# Altium schematic sheet fpga-bank3-outside.SchDoc: FPGA - Bank 3
size Letter; CheckedBy: E. Chiu; CompanyName: Brinton Engineering, LLC; DrawnBy: J. Brinton; Engineer: J. Brinton; Address1: 3479 Edison Way; Address2: Menlo Park CA 94025; Address3: +1 (877) 778-8435; Address4: brintonengineering.com; Revision: 1; SheetNumber: 11; SheetTotal: 48
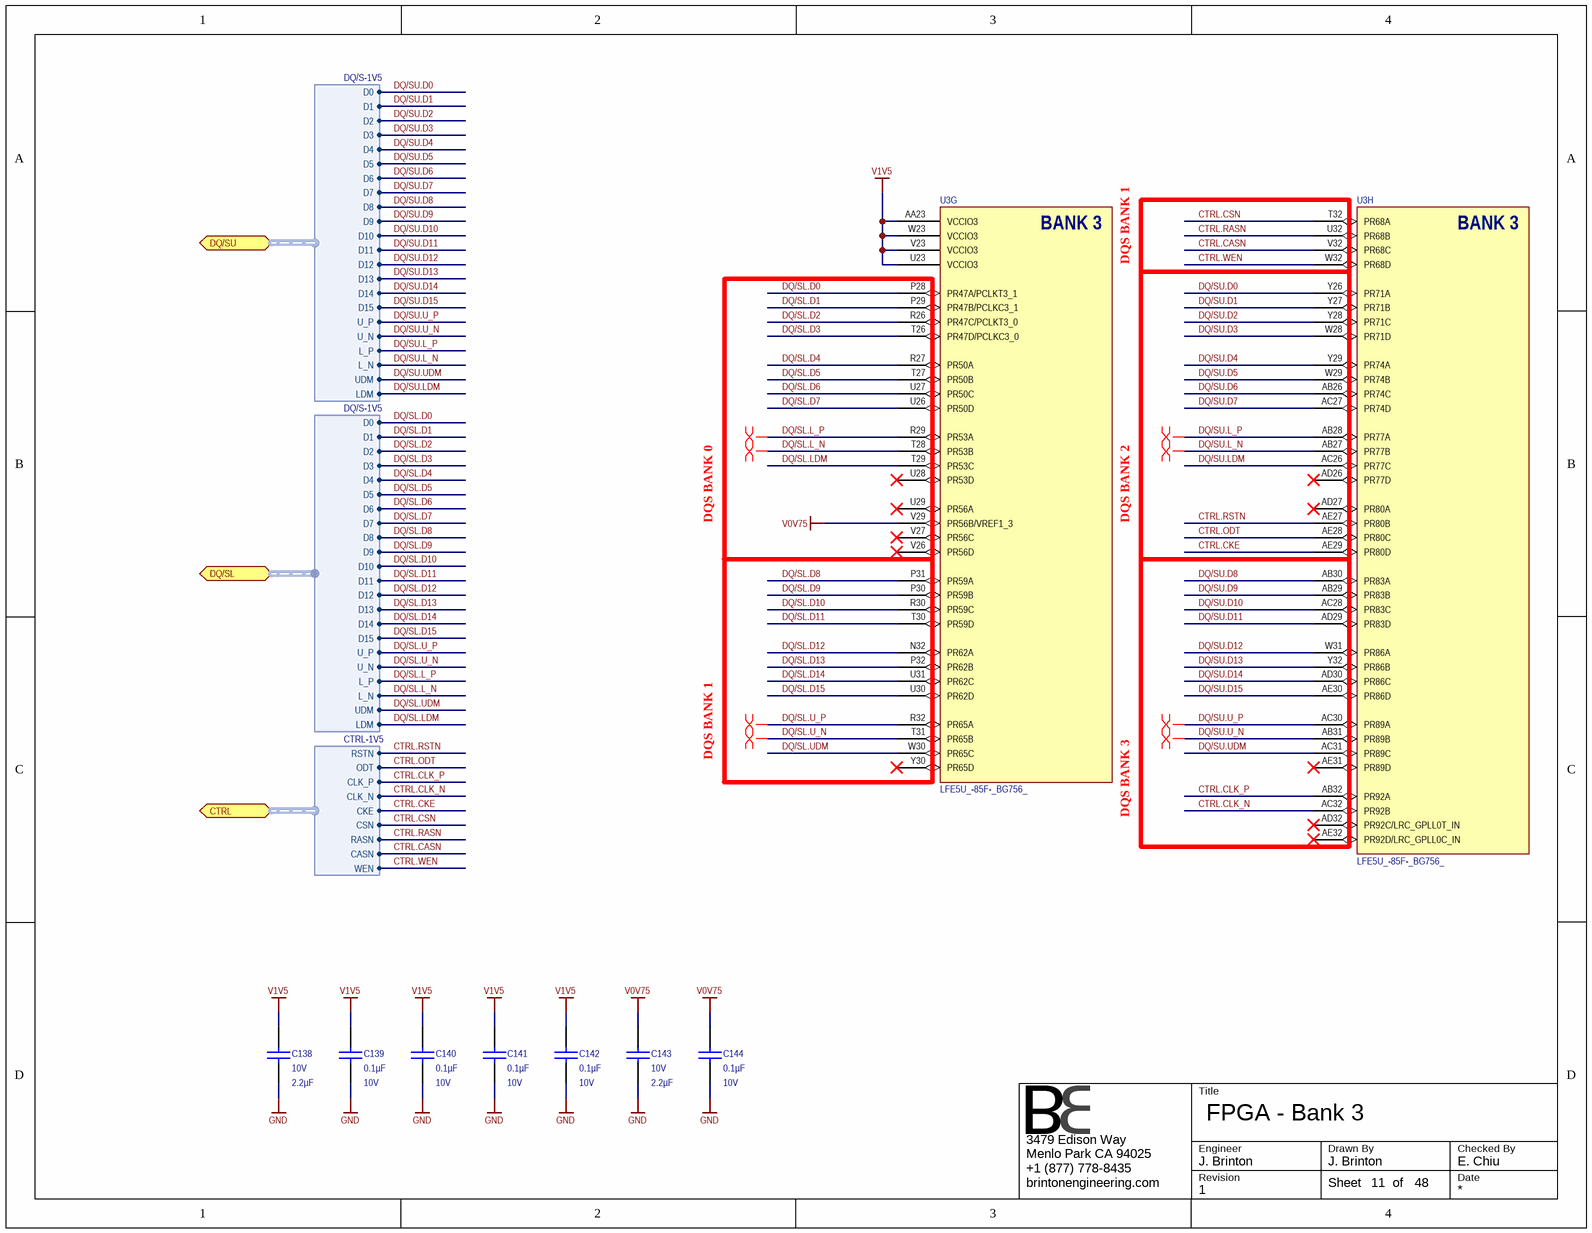
[diagram p0: fpga-bank3-outside.SchDoc]

## Parts
C138  Voltage - Rated: 10V  Capacitance: 2.2µF  [CAPC1608X90N]  (hidden comment: GRM188R71A225KE15D)
C139  Capacitance: 0.1µF  Voltage - Rated: 10V  [CAPC1005X56N]  (hidden comment: GRM155R71A104KA01J)
C140  Capacitance: 0.1µF  Voltage - Rated: 10V  [CAPC1005X56N]  (hidden comment: GRM155R71A104KA01J)
C141  Capacitance: 0.1µF  Voltage - Rated: 10V  [CAPC1005X56N]  (hidden comment: GRM155R71A104KA01J)
C142  Capacitance: 0.1µF  Voltage - Rated: 10V  [CAPC1005X56N]  (hidden comment: GRM155R71A104KA01J)
C143  Voltage - Rated: 10V  Capacitance: 2.2µF  [CAPC1608X90N]  (hidden comment: GRM188R71A225KE15D)
C144  Capacitance: 0.1µF  Voltage - Rated: 10V  [CAPC1005X56N]  (hidden comment: GRM155R71A104KA01J)
U3  LFE5U_-85F-_BG756_  [caBGA756]  (parts G,H of 19)

## Ports
CTRL (harness CTRL-1V5), DQ/SL (harness DQ/S-1V5), DQ/SU (harness DQ/S-1V5)

## Harnesses
DQ/S-1V5: D0, D1, D2, D3, D4, D5, D6, D7, D8, D9, D10, D11, D12, D13, D14, D15, U_P, U_N, L_P, L_N, UDM, LDM
CTRL-1V5: RSTN, CLK_P, CLK_N, CKE, CSN, RASN, CASN, WEN, ODT

## Nets
GND: C138.1 C139.1 C140.1 C141.1 C142.1 C143.1 C144.1
V0V75: C143.2 C144.2 U3.V29(PR56B/VREF1_3)
V1V5: C138.2 C139.2 C140.2 C141.2 C142.2 U3.AA23(VCCIO3) U3.U23(VCCIO3) U3.V23(VCCIO3) U3.W23(VCCIO3)
CTRL.CASN: U3.V32(PR68C) ; port CTRL.CASN
CTRL.CKE: U3.AE29(PR80D) ; port CTRL.CKE
CTRL.CLK_N: U3.AC32(PR92B) ; port CTRL.CLK_N
CTRL.CLK_P: U3.AB32(PR92A) ; port CTRL.CLK_P
CTRL.CSN: U3.T32(PR68A) ; port CTRL.CSN
CTRL.ODT: U3.AE28(PR80C) ; port CTRL.ODT
CTRL.RASN: U3.U32(PR68B) ; port CTRL.RASN
CTRL.RSTN: U3.AE27(PR80B) ; port CTRL.RSTN
CTRL.WEN: U3.W32(PR68D) ; port CTRL.WEN
DQ/SL.D0: U3.P28(PR47A/PCLKT3_1) ; port DQ/SL.D0
DQ/SL.D1: U3.P29(PR47B/PCLKC3_1) ; port DQ/SL.D1
DQ/SL.D2: U3.R26(PR47C/PCLKT3_0) ; port DQ/SL.D2
DQ/SL.D3: U3.T26(PR47D/PCLKC3_0) ; port DQ/SL.D3
DQ/SL.D4: U3.R27(PR50A) ; port DQ/SL.D4
DQ/SL.D5: U3.T27(PR50B) ; port DQ/SL.D5
DQ/SL.D6: U3.U27(PR50C) ; port DQ/SL.D6
DQ/SL.D7: U3.U26(PR50D) ; port DQ/SL.D7
DQ/SL.D8: U3.P31(PR59A) ; port DQ/SL.D8
DQ/SL.D9: U3.P30(PR59B) ; port DQ/SL.D9
DQ/SL.D10: U3.R30(PR59C) ; port DQ/SL.D10
DQ/SL.D11: U3.T30(PR59D) ; port DQ/SL.D11
DQ/SL.D12: U3.N32(PR62A) ; port DQ/SL.D12
DQ/SL.D13: U3.P32(PR62B) ; port DQ/SL.D13
DQ/SL.D14: U3.U31(PR62C) ; port DQ/SL.D14
DQ/SL.D15: U3.U30(PR62D) ; port DQ/SL.D15
DQ/SL.L_N: U3.T28(PR53B) ; port DQ/SL.L_N
DQ/SL.L_P: U3.R29(PR53A) ; port DQ/SL.L_P
DQ/SL.LDM: U3.T29(PR53C) ; port DQ/SL.LDM
DQ/SL.U_N: U3.T31(PR65B) ; port DQ/SL.U_N
DQ/SL.U_P: U3.R32(PR65A) ; port DQ/SL.U_P
DQ/SL.UDM: U3.W30(PR65C) ; port DQ/SL.UDM
DQ/SU.D0: U3.Y26(PR71A) ; port DQ/SU.D0
DQ/SU.D1: U3.Y27(PR71B) ; port DQ/SU.D1
DQ/SU.D2: U3.Y28(PR71C) ; port DQ/SU.D2
DQ/SU.D3: U3.W28(PR71D) ; port DQ/SU.D3
DQ/SU.D4: U3.Y29(PR74A) ; port DQ/SU.D4
DQ/SU.D5: U3.W29(PR74B) ; port DQ/SU.D5
DQ/SU.D6: U3.AB26(PR74C) ; port DQ/SU.D6
DQ/SU.D7: U3.AC27(PR74D) ; port DQ/SU.D7
DQ/SU.D8: U3.AB30(PR83A) ; port DQ/SU.D8
DQ/SU.D9: U3.AB29(PR83B) ; port DQ/SU.D9
DQ/SU.D10: U3.AC28(PR83C) ; port DQ/SU.D10
DQ/SU.D11: U3.AD29(PR83D) ; port DQ/SU.D11
DQ/SU.D12: U3.W31(PR86A) ; port DQ/SU.D12
DQ/SU.D13: U3.Y32(PR86B) ; port DQ/SU.D13
DQ/SU.D14: U3.AD30(PR86C) ; port DQ/SU.D14
DQ/SU.D15: U3.AE30(PR86D) ; port DQ/SU.D15
DQ/SU.L_N: U3.AB27(PR77B) ; port DQ/SU.L_N
DQ/SU.L_P: U3.AB28(PR77A) ; port DQ/SU.L_P
DQ/SU.LDM: U3.AC26(PR77C) ; port DQ/SU.LDM
DQ/SU.U_N: U3.AB31(PR89B) ; port DQ/SU.U_N
DQ/SU.U_P: U3.AC30(PR89A) ; port DQ/SU.U_P
DQ/SU.UDM: U3.AC31(PR89C) ; port DQ/SU.UDM

Not connected (* = marked no-connect by the designer): U3 AD26(PR77D)* AD27(PR80A)* AD32(PR92C/LRC_GPLL0T_IN)* AE31(PR89D)* AE32(PR92D/LRC_GPLL0C_IN)* U28(PR53D)* U29(PR56A)* V26(PR56D)* V27(PR56C)* Y30(PR65D)*

## Layout directives
differential pair: DQ/SL.L_N, DQ/SL.L_P, DQ/SL.U_N, DQ/SL.U_P, DQ/SU.L_N, DQ/SU.L_P, DQ/SU.U_N, DQ/SU.U_P

## Notes on the sheet
- DQS BANK 1
- DQS BANK 0
- DQS BANK 2
- DQS BANK 3
- Title
- Engineer
- Revision
- Drawn By
- Checked By
- Date
- Sheet
- of
- (in symbol LFE5U_-85F-_BG756_, part G) BANK 3
- (in symbol LFE5U_-85F-_BG756_, part H) BANK 3

## Library data of the parts
C138 C143 = GRM188R71A225KE15D: CAP CER 2.2UF 10V 10% X7R 0603; Manufacturer: Murata Electronics North America; Manufacturer P/N: GRM188R71A225KE15D; Operating Temperature: -55°C ~ 125°C; Thickness (Max): 0.035" (0.90mm); Tolerance: ±10%; Package / Case: 0603 (1608 Metric); Temperature Coefficient: X7R; Supplier 1: Newark; Supplier 2: Digi-Key; RoHS: RoHS Compliant; Size / Dimension: 0.063" L x 0.031" W (1.60mm x 0.80mm); Mounting Type: Surface Mount, MLCC; ComponentLink1URL: http://www.murata.com/~/media/webrenewal/support/library/catalog/products/capacitor/mlcc/c02e.ashx; ComponentLink1Description: http://www.murata.com/~/media/webrenewal/support/library/catalog/products/capacitor/mlcc/c02e.ashx; Supplier Part Number 1: 72R4209; Supplier Part Number 2: 490-4520-1-ND
C139-C142 C144 = GRM155R71A104KA01J: CAP CER 0.1UF 10V 10% X7R 0402; Manufacturer: Murata Electronics North America; Manufacturer P/N: GRM155R71A104KA01J; Operating Temperature: -55°C ~ 125°C; Thickness (Max): 0.022" (0.55mm); Size / Dimension: 0.039" L x 0.020" W (1.00mm x 0.50mm); RoHS: RoHS Compliant; Mounting Type: Surface Mount, MLCC; Supplier 1: Digi-Key; ComponentLink1URL: http://www.murata.com/~/media/webrenewal/support/library/catalog/products/capacitor/mlcc/c02e.ashx; ComponentLink1Description: http://www.murata.com/~/media/webrenewal/support/library/catalog/products/capacitor/mlcc/c02e.ashx; Supplier Part Number 1: 490-6322-1-ND; Temperature Coefficient: X7R; Package / Case: 0402 (1005 Metric); Tolerance: ±10%
U3 = LFE5U_-85F-_BG756_: ECP5 FPGA, 85k LUT, 756-caBGA; Manufacturer: Lattice Semiconductor; Manufacturer P/N: LFE5U_-85F-_BG756_